# EAGLE design LTC_Balancer3 (EAGLE 5.06)
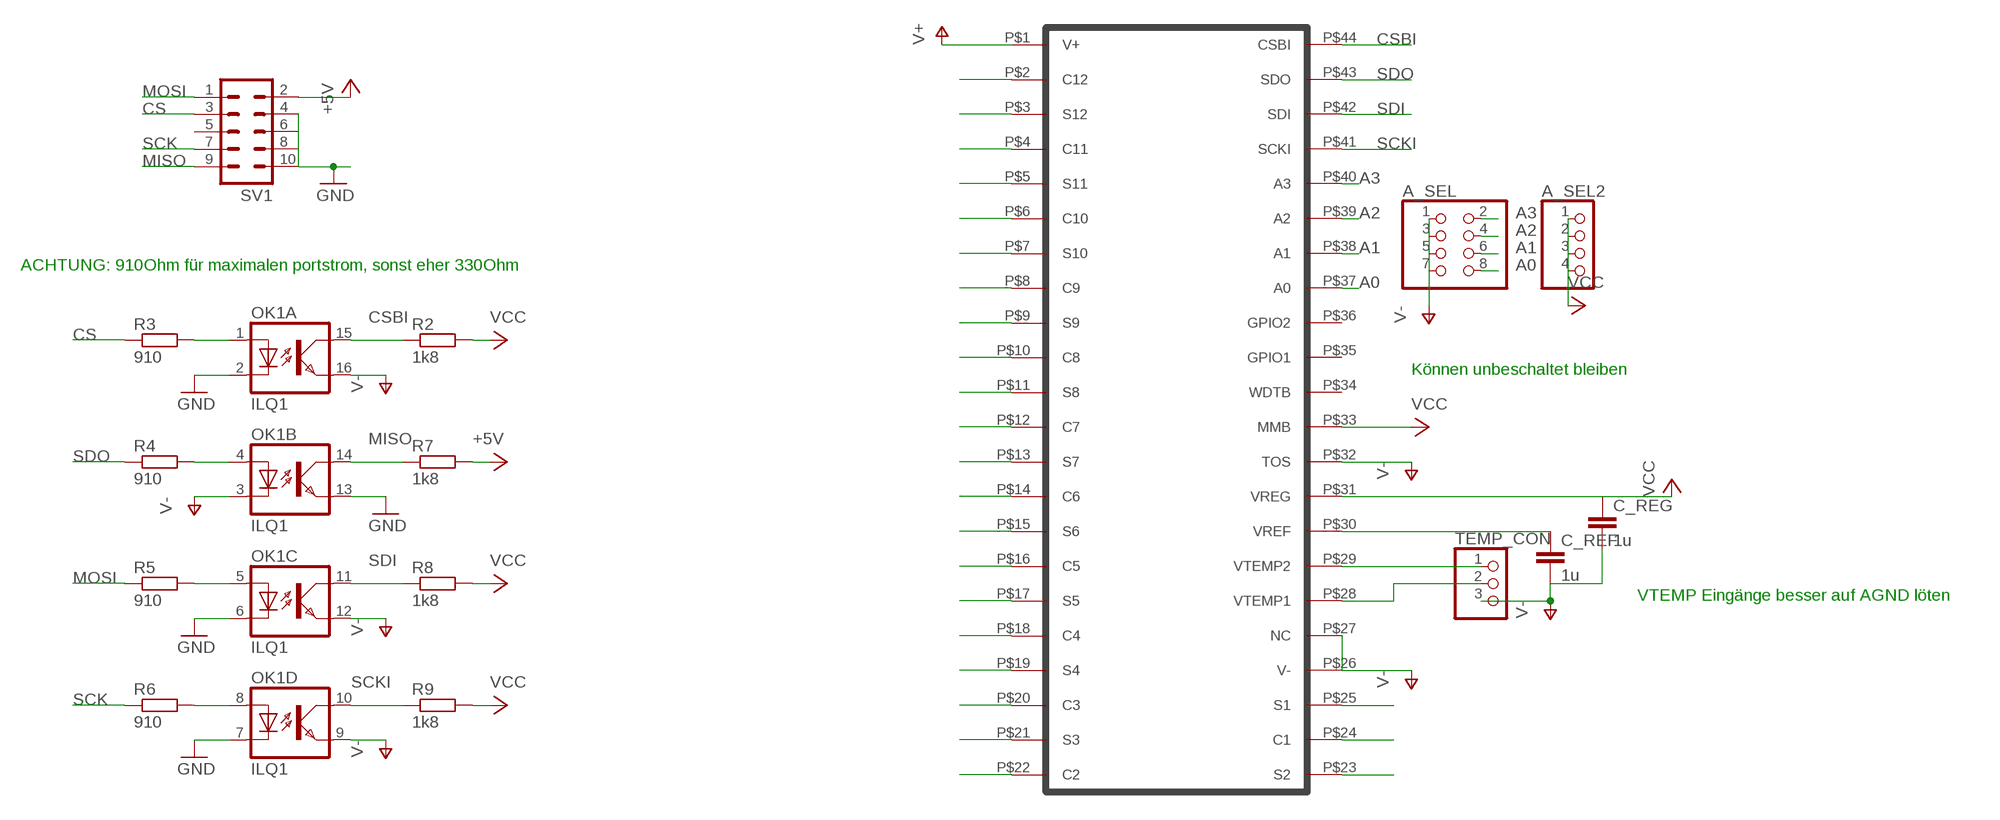
[diagram p0: schematic, sheet 1, part 1 of 2]
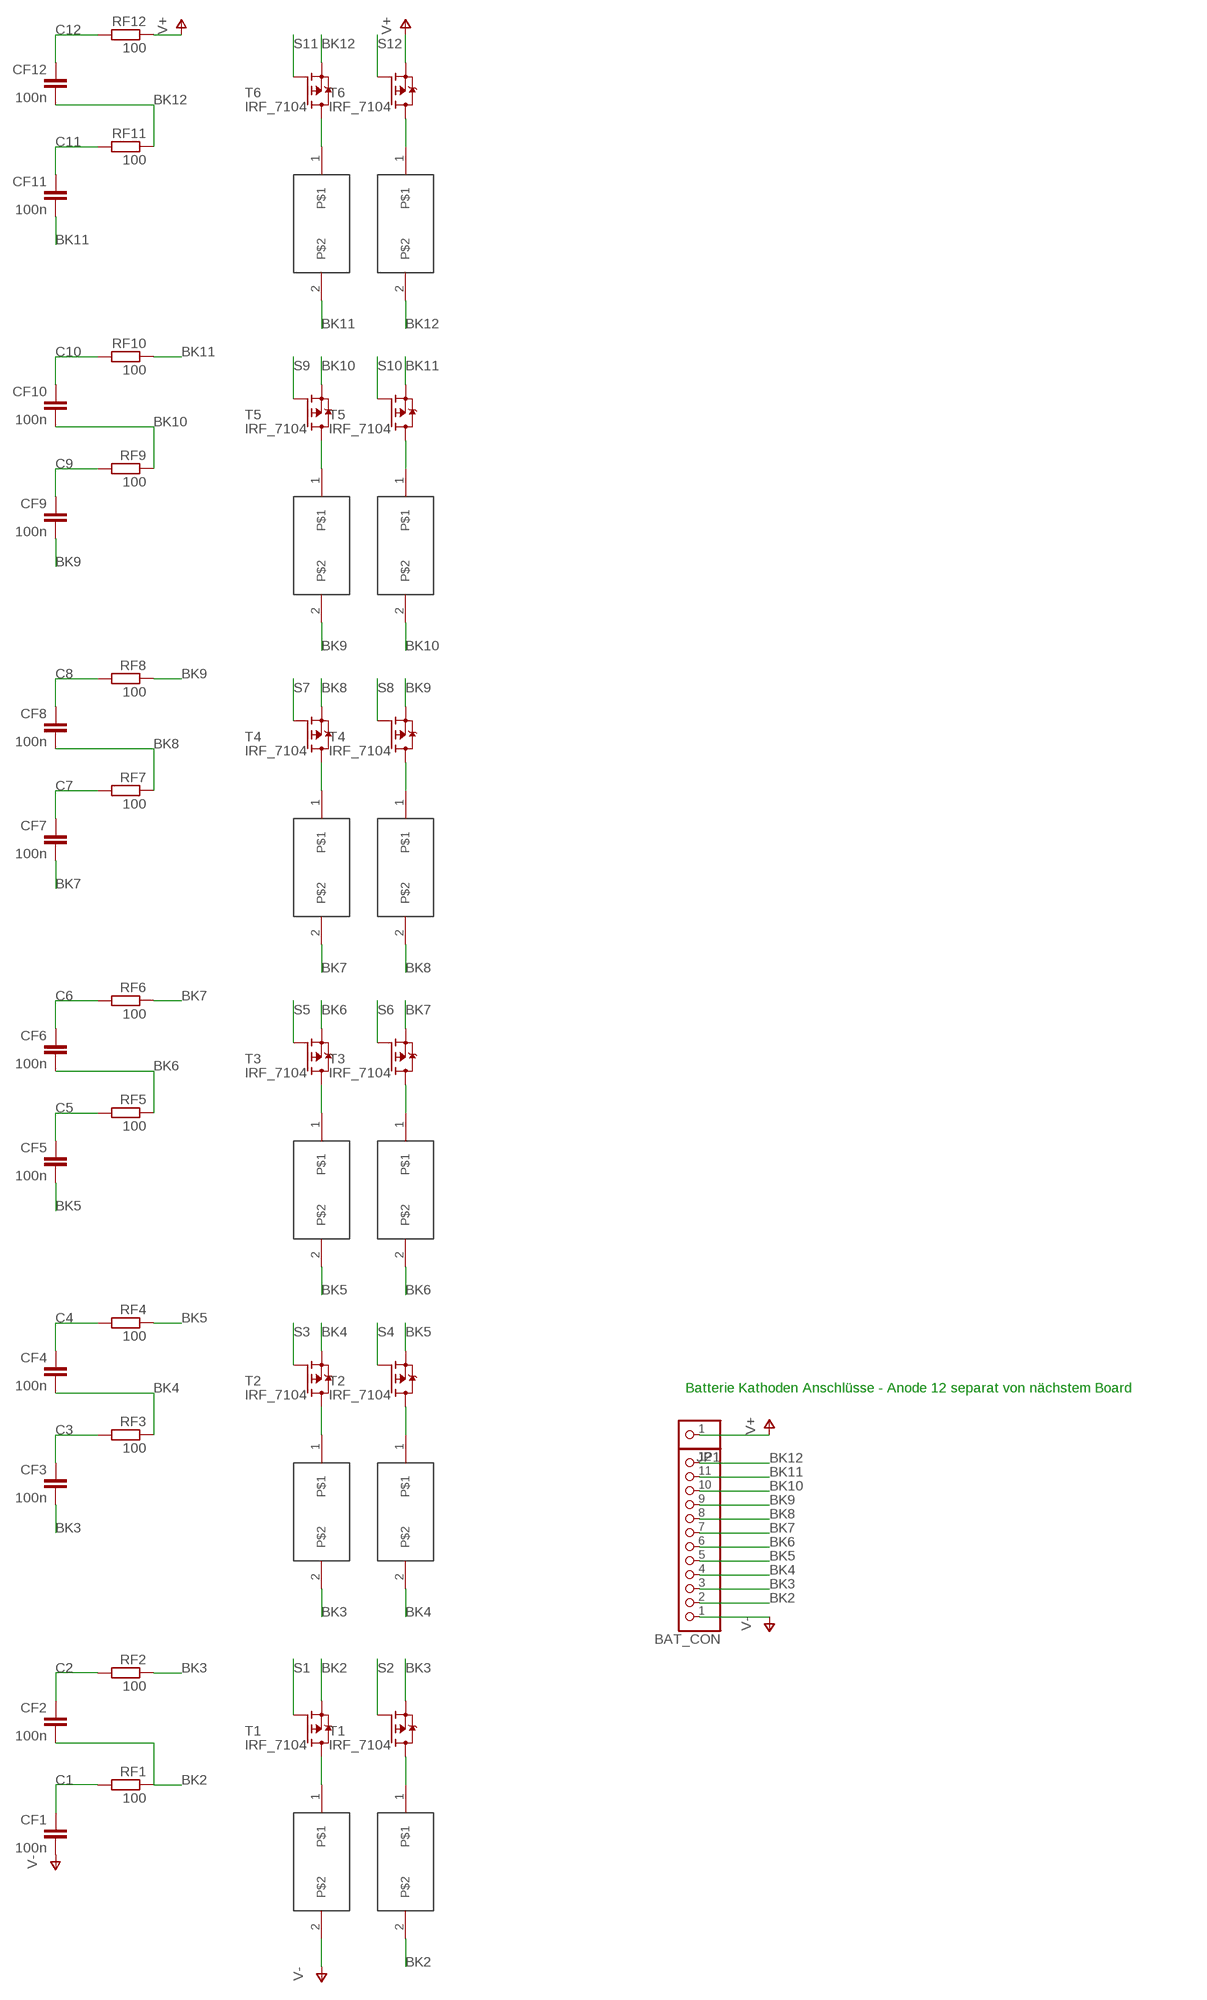
[diagram p1: schematic, sheet 1, part 2 of 2]

## Parts
A_SEL  PINHD-2X4  [2X04]
A_SEL2  PINHD-1X4  [1X04]
BAT_CON  PINHD-1X12  [1X12]
C_REF  1u  C-EUC1206  [C1206]
C_REG  1u  C-EUC1206  [C1206]
CF1  100n  C-EUC1206  [C1206]
CF2  100n  C-EUC1206  [C1206]
CF3  100n  C-EUC1206  [C1206]
CF4  100n  C-EUC1206  [C1206]
CF5  100n  C-EUC1206  [C1206]
CF6  100n  C-EUC1206  [C1206]
CF7  100n  C-EUC1206  [C1206]
CF8  100n  C-EUC1206  [C1206]
CF9  100n  C-EUC1206  [C1206]
CF10  100n  C-EUC1206  [C1206]
CF11  100n  C-EUC1206  [C1206]
CF12  100n  C-EUC1206  [C1206]
JP1  PINHD-1X1  [1X01]
OK1  ILQ1  [DIL16]
R2  1k8  R-EU_R1206  [R1206]
R3  910  R-EU_R1206  [R1206]
R4  910  R-EU_R1206  [R1206]
R5  910  R-EU_R1206  [R1206]
R6  910  R-EU_R1206  [R1206]
R7  1k8  R-EU_R1206  [R1206]
R8  1k8  R-EU_R1206  [R1206]
R9  1k8  R-EU_R1206  [R1206]
RF1  100  R-EU_R1206  [R1206]
RF2  100  R-EU_R1206  [R1206]
RF3  100  R-EU_R1206  [R1206]
RF4  100  R-EU_R1206  [R1206]
RF5  100  R-EU_R1206  [R1206]
RF6  100  R-EU_R1206  [R1206]
RF7  100  R-EU_R1206  [R1206]
RF8  100  R-EU_R1206  [R1206]
RF9  100  R-EU_R1206  [R1206]
RF10  100  R-EU_R1206  [R1206]
RF11  100  R-EU_R1206  [R1206]
RF12  100  R-EU_R1206  [R1206]
RL1  R_5W  [R_5W]
RL2  R_5W  [R_5W]
RL3  R_5W  [R_5W]
RL4  R_5W  [R_5W]
RL5  R_5W  [R_5W]
RL6  R_5W  [R_5W]
RL7  R_5W  [R_5W]
RL8  R_5W  [R_5W]
RL9  R_5W  [R_5W]
RL10  R_5W  [R_5W]
RL11  R_5W  [R_5W]
RL12  R_5W  [R_5W]
SV1  ML10  [ML10]
T1  IRF_7104  [SO8]
T2  IRF_7104  [SO8]
T3  IRF_7104  [SO8]
T4  IRF_7104  [SO8]
T5  IRF_7104  [SO8]
T6  IRF_7104  [SO8]
TEMP_CON  PINHD-1X3  [1X03]
U$1  LTC6802-2  [SSOP48]

## Nets
+5V: R7.2 SV1.2
A0: A_SEL.8 U$1.P$37(A0)
A1: A_SEL.6 U$1.P$38(A1)
A2: A_SEL.4 U$1.P$39(A2)
A3: A_SEL.2 U$1.P$40(A3)
ASD: RL5.1 T3.7(D2)
BK2: BAT_CON.2 CF2.2 RF1.1 RL2.2 T1.1(S2)
BK3: BAT_CON.3 CF3.2 RF2.1 RL3.2 T1.3(S1)
BK4: BAT_CON.4 CF4.2 RF3.1 RL4.2 T2.1(S2)
BK5: BAT_CON.5 CF5.2 RF4.1 RL5.2 T2.3(S1)
BK6: BAT_CON.6 CF6.2 RF5.1 RL6.2 T3.1(S2)
BK7: BAT_CON.7 CF7.2 RF6.1 RL7.2 T3.3(S1)
BK8: BAT_CON.8 CF8.2 RF7.1 RL8.2 T4.1(S2)
BK9: BAT_CON.9 CF9.2 RF8.1 RL9.2 T4.3(S1)
BK10: BAT_CON.10 CF10.2 RF9.1 RL10.2 T5.1(S2)
BK11: BAT_CON.11 CF11.2 RF10.1 RL11.2 T5.3(S1)
BK12: BAT_CON.12 CF12.2 RF11.1 RL12.2 T6.1(S2)
C1: CF1.1 RF1.2 U$1.P$24(C1)
C2: CF2.1 RF2.2 U$1.P$22(C2)
C3: CF3.1 RF3.2 U$1.P$20(C3)
C4: CF4.1 RF4.2 U$1.P$18(C4)
C5: CF5.1 RF5.2 U$1.P$16(C5)
C6: CF6.1 RF6.2 U$1.P$14(C6)
C7: CF7.1 RF7.2 U$1.P$12(C7)
C8: CF8.1 RF8.2 U$1.P$10(C8)
C9: CF9.1 RF9.2 U$1.P$8(C9)
C10: CF10.1 RF10.2 U$1.P$6(C10)
C11: CF11.1 RF11.2 U$1.P$4(C11)
C12: CF12.1 RF12.2 U$1.P$2(C12)
CS: R3.1 SV1.3
CSBI: OK1.15(A:COL) R2.1 U$1.P$44(CSBI)
GND: OK1.2(A:C) OK1.6(C:C) OK1.7(D:C) OK1.13(B:EMIT) SV1.4 SV1.6 SV1.8 SV1.10
MISO: OK1.14(B:COL) R7.1 SV1.9
MOSI: R5.1 SV1.1
N$1: OK1.1(A:A) R3.2
N$2: TEMP_CON.1 U$1.P$29(VTEMP2)
N$3: C_REF.1 U$1.P$30(VREF)
N$4: TEMP_CON.2 U$1.P$28(VTEMP1)
N$5: RL3.1 T2.7(D2)
N$6: RL4.1 T2.5(D1)
N$8: RL1.1 T1.7(D2)
N$9: RL2.1 T1.5(D1)
N$10: RL6.1 T3.5(D1)
N$11: RL7.1 T4.7(D2)
N$12: RL8.1 T4.5(D1)
N$13: RL9.1 T5.7(D2)
N$14: RL10.1 T5.5(D1)
N$15: RL11.1 T6.7(D2)
N$16: RL12.1 T6.5(D1)
N$19: OK1.4(B:A) R4.2
N$20: OK1.5(C:A) R5.2
N$21: OK1.8(D:A) R6.2
S1: T1.2(G2) U$1.P$25(S1)
S2: T1.4(G1) U$1.P$23(S2)
S3: T2.2(G2) U$1.P$21(S3)
S4: T2.4(G1) U$1.P$19(S4)
S5: T3.2(G2) U$1.P$17(S5)
S6: T3.4(G1) U$1.P$15(S6)
S7: T4.2(G2) U$1.P$13(S7)
S8: T4.4(G1) U$1.P$11(S8)
S9: T5.2(G2) U$1.P$9(S9)
S10: T5.4(G1) U$1.P$7(S10)
S11: T6.2(G2) U$1.P$5(S11)
S12: T6.4(G1) U$1.P$3(S12)
SCK: R6.1 SV1.7
SCKI: OK1.10(D:COL) R9.1 U$1.P$41(SCKI)
SDI: OK1.11(C:COL) R8.1 U$1.P$42(SDI)
SDO: R4.1 U$1.P$43(SDO)
V+: JP1.1 RF12.1 T6.3(S1)
V-: A_SEL.1 A_SEL.3 A_SEL.5 A_SEL.7 BAT_CON.1 C_REF.2 C_REG.2 CF1.2 OK1.3(B:C) OK1.9(D:EMIT) OK1.12(C:EMIT) OK1.16(A:EMIT) RL1.2 TEMP_CON.3 U$1.P$26(V-) U$1.P$27(NC) U$1.P$32(TOS)
VCC: A_SEL2.1 A_SEL2.2 A_SEL2.3 A_SEL2.4 C_REG.1 R2.2 R8.2 R9.2 U$1.P$31(VREG) U$1.P$33(MMB)
Unconnected: SV1.5 U$1.P$1(V+) U$1.P$34(WDTB) U$1.P$35(GPIO1) U$1.P$36(GPIO2)

## Notes on the sheet
- Batterie Kathoden Anschlüsse - Anode 12 separat von nächstem Board
- ACHTUNG: 910Ohm für maximalen portstrom, sonst eher 330Ohm
- Können unbeschaltet bleiben
- VTEMP Eingänge besser auf AGND löten

## Library data of the parts
A_SEL = pinhead:PINHD-2X4: PIN HEADER
A_SEL2 = pinhead:PINHD-1X4: PIN HEADER
BAT_CON = pinhead:PINHD-1X12: PIN HEADER
C_REF C_REG CF1-CF12 = rcl:C-EU: CAPACITOR, European symbol
JP1 = pinhead:PINHD-1X1: PIN HEADER
OK1 = optocoupler:ILQ1: SIEMENS OPTO COUPLER
R2-R9 RF1-RF12 = rcl:R-EU_: RESISTOR, European symbol
RL1-RL12 = R_Power:R_5W
SV1 = con-ml:ML10: HARTING
T1-T6 = IRF_7104:IRF_7104
TEMP_CON = pinhead:PINHD-1X3: PIN HEADER
U$1 = LTC6802:LTC6802-2

## Board
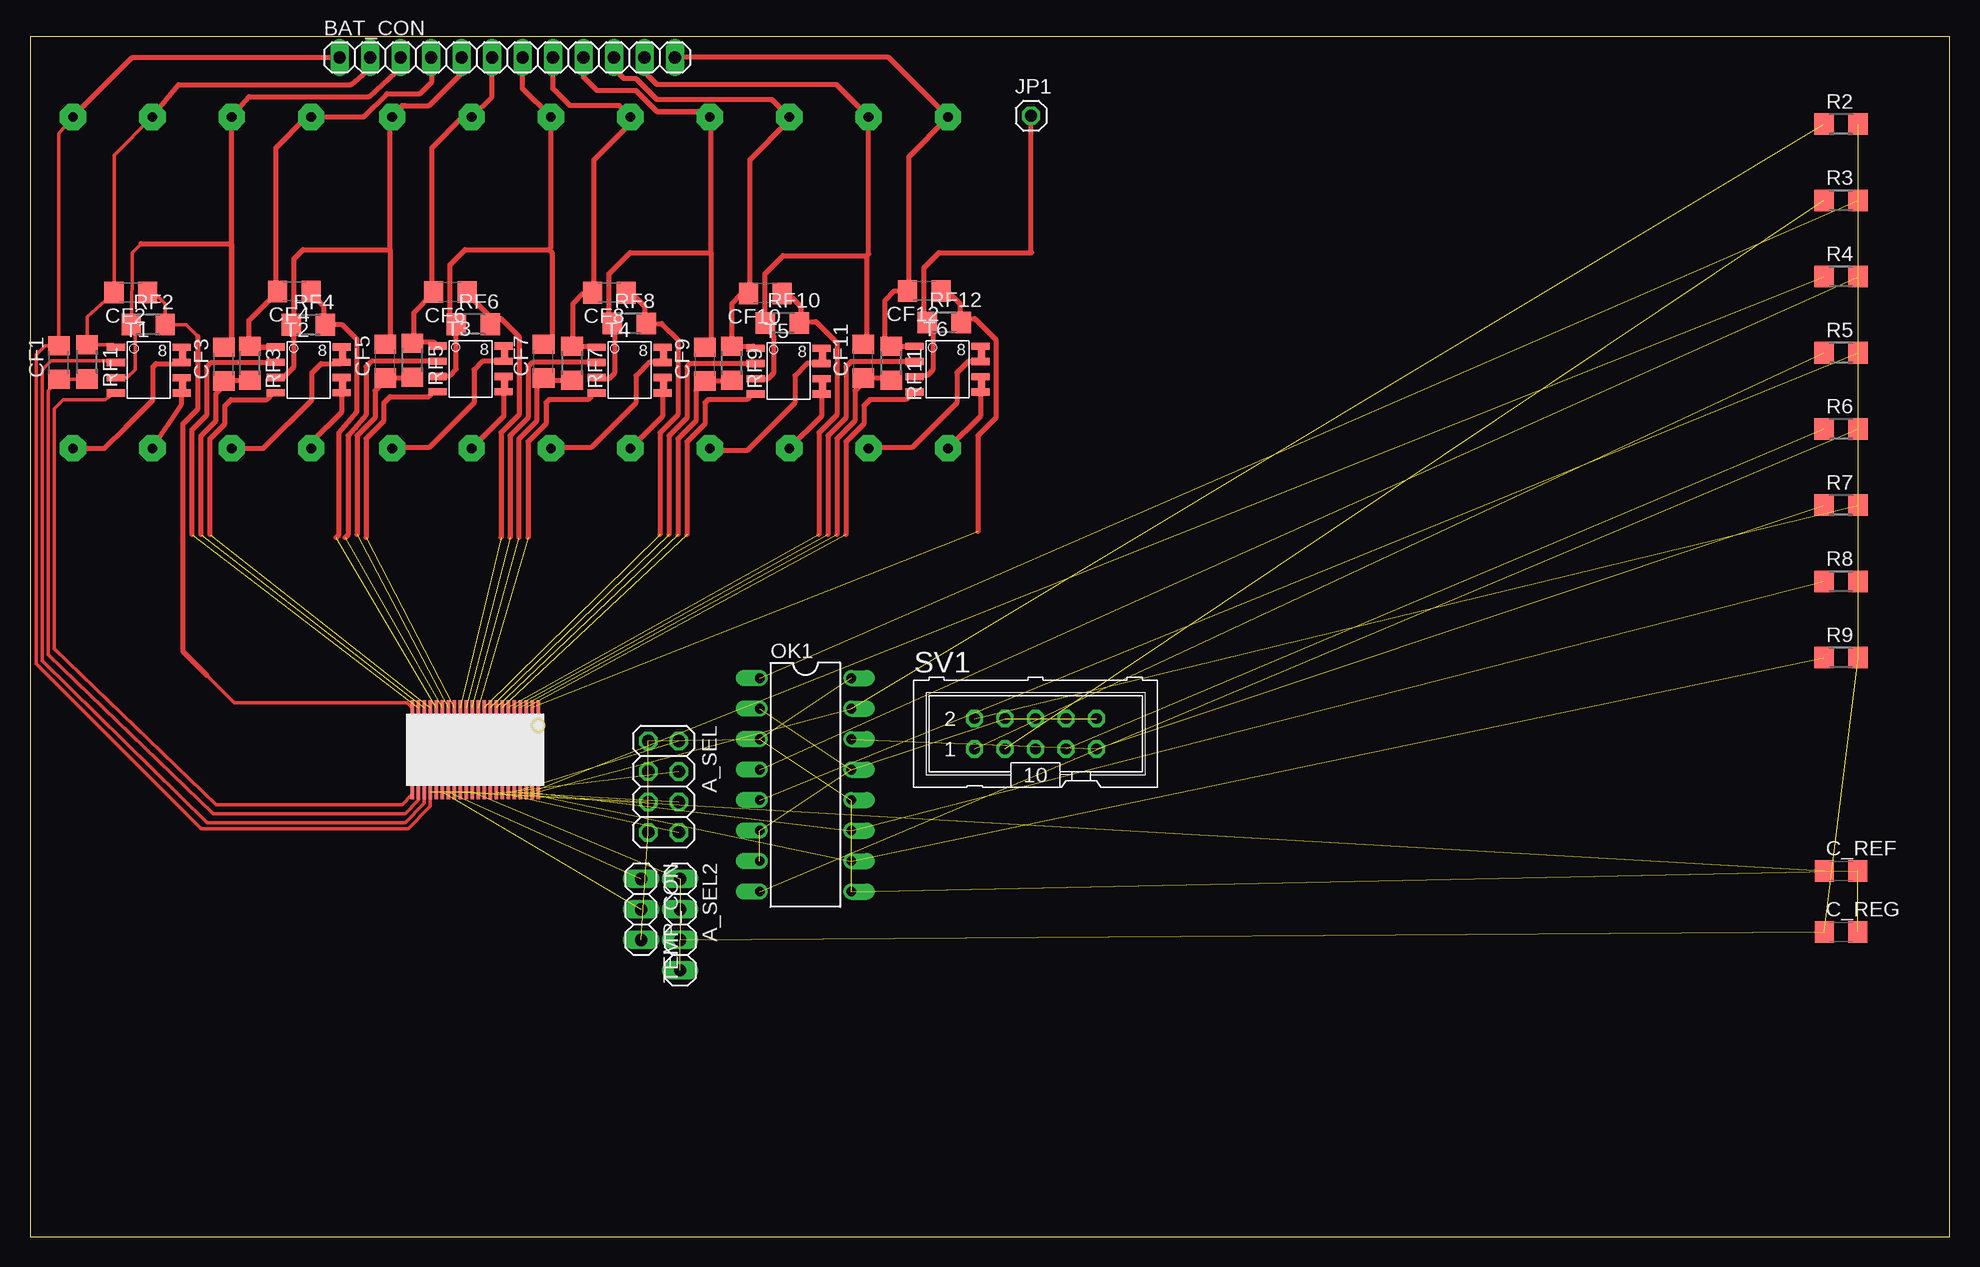
[diagram p2: board, top side]
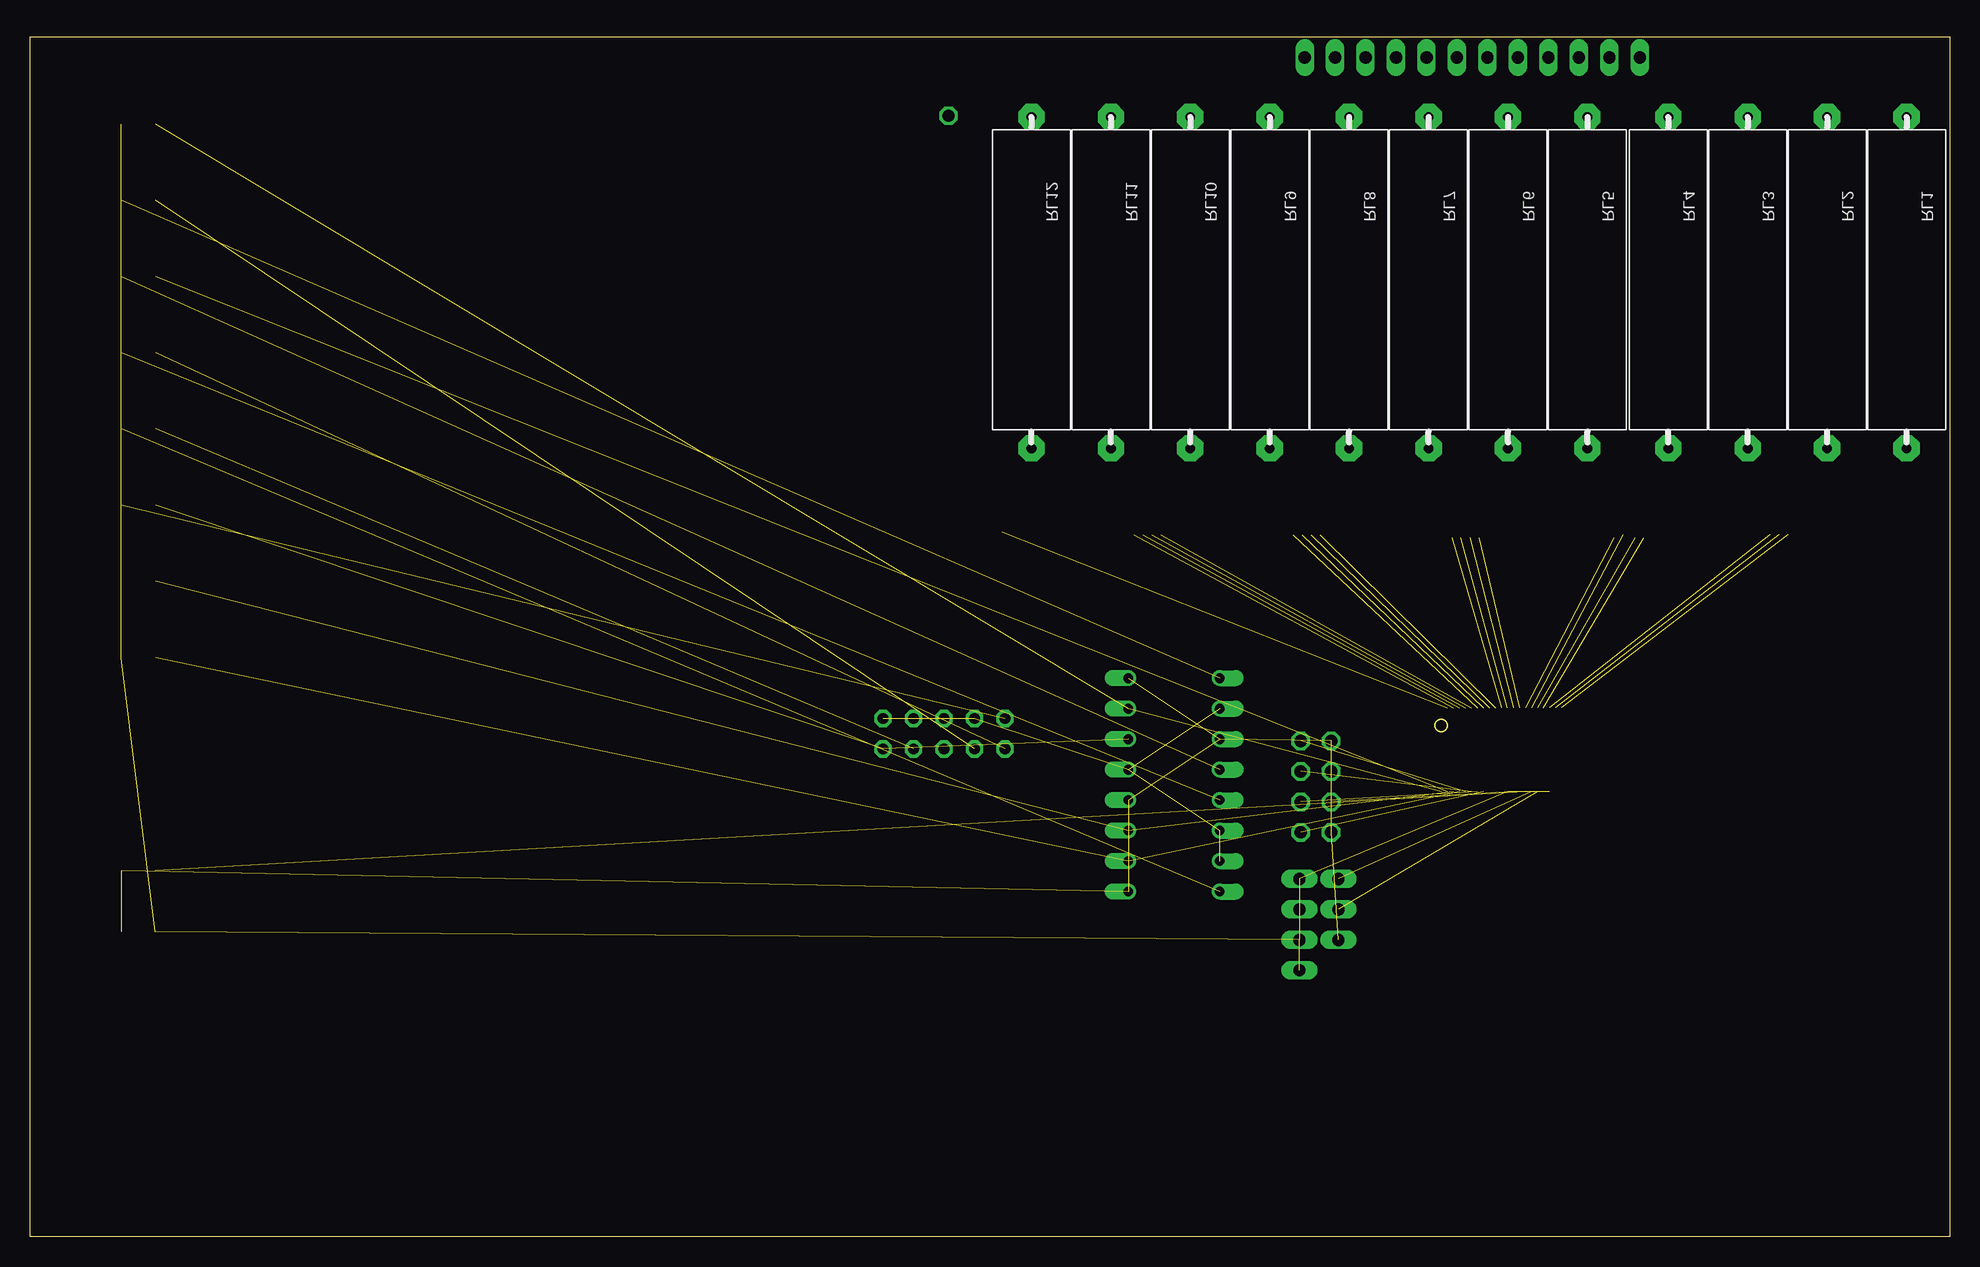
[diagram p3: board, bottom side, seen from below]

Size 160 x 100 mm. Coordinates in mm from the lower left corner, seen from the top.
Outline: 0,0 160,0 160,100 0,100 0,0
Copper layers (1*16): Top 0.035mm / dielectric 1.5mm / Bottom 0.035mm
Design rules "default": minimum track width 10mil, minimum drill 24mil, track to track 8mil, track to pad 8mil, pad to pad 8mil, via to via 8mil, smd to smd 8mil, copper to edge 40mil, drill to drill 8mil, minimum pad ring 10mil, minimum via ring 8mil, stop-mask expansion 4mil, vias tented up to drill 0mil, thermal gap 10mil

### Footprints (pad centres in the part's own frame; a part is rotated, then mirrored left to right if it is on the bottom)
2X04 = drill 1.016 octagon: 1 -3.81,-1.27; 2 -3.81,1.27; 3 -1.27,-1.27; 4 -1.27,1.27; 5 1.27,-1.27; 6 1.27,1.27; 7 3.81,-1.27; 8 3.81,1.27
1X04 = drill 1.016 long: 1 -3.81,0; 2 -1.27,0; 3 1.27,0; 4 3.81,0
1X12 = drill 1.016 long: 1 -13.97,0; 2 -11.43,0; 3 -8.89,0; 4 -6.35,0; 5 -3.81,0; 6 -1.27,0; 7 1.27,0; 8 3.81,0; 9 6.35,0; 10 8.89,0; 11 11.43,0; 12 13.97,0
C1206 = smd 1.6 x 1.8: 1 -1.4,0; 2 1.4,0
1X01 = drill 1.016 octagon: 1 0,0
DIL16 = drill 0.813 offset: 1 -8.89,-3.81; 2 -6.35,-3.81; 3 -3.81,-3.81; 4 -1.27,-3.81; 5 1.27,-3.81; 6 3.81,-3.81; 7 6.35,-3.81; 8 8.89,-3.81; 9 8.89,3.81; 10 6.35,3.81; 11 3.81,3.81; 12 1.27,3.81; 13 -1.27,3.81; 14 -3.81,3.81; 15 -6.35,3.81; 16 -8.89,3.81
R1206 = smd 1.6 x 1.803: 1 -1.422,0; 2 1.422,0
R_5W = drill 0.813 pad 2.184 octagon: 1 0.46,0; 2 28.08,0
ML10 = drill 0.914 octagon: 1 -5.08,-1.27; 2 -5.08,1.27; 3 -2.54,-1.27; 4 -2.54,1.27; 5 0,-1.27; 6 0,1.27; 7 2.54,-1.27; 8 2.54,1.27; 9 5.08,-1.27; 10 5.08,1.27
SO8 = smd 1.524 x 0.61: 1 1.067,4.445; 2 1.067,3.175; 3 1.067,1.905; 4 1.067,0.635; 5 6.553,0.635; 6 6.553,1.905; 7 6.553,3.175; 8 6.553,4.445 | smd 0.61 x 1.524: 9 6.635,3.703; 10 6.635,1.203
1X03 = drill 1.016 long: 1 -2.54,0; 2 0,0; 3 2.54,0
SSOP48 = smd 0.3 x 1.25: P$1 0,0.5; P$2 0.5,0.5; P$3 1,0.5; P$4 1.5,0.5; P$5 2,0.5; P$6 2.5,0.5; P$7 3,0.5; P$8 3.5,0.5; P$9 4,0.5; P$10 4.5,0.5; P$11 5,0.5; P$12 5.5,0.5; P$13 6,0.5; P$14 6.5,0.5; P$15 7,0.5; P$16 7.5,0.5; P$17 8,0.5; P$18 8.5,0.5; P$19 9,0.5; P$20 9.5,0.5; P$21 10,0.5; P$22 10.5,0.5; P$23 10.5,7.5; P$24 10,7.5; P$25 9.5,7.5; P$26 9,7.5; P$27 8.5,7.5; P$28 8,7.5; P$29 7.5,7.5; P$30 7,7.5; P$31 6.5,7.5; P$32 6,7.5; P$33 5.5,7.5; P$34 5,7.5; P$35 4.5,7.5; P$36 4,7.5; P$37 3.5,7.5; P$38 3,7.5; P$39 2.5,7.5; P$40 2,7.5; P$41 1.5,7.5; P$42 1,7.5; P$43 0.5,7.5; P$44 0,7.5

### Placement (x,y rotation side)
A_SEL  52.81,37.5 270 top
A_SEL2  54.19,26 270 top
BAT_CON  39.78,98.27 0 top
C_REF  150.96,30.48 0 top
C_REG  150.96,25.4 0 top
CF1  2.41,72.85 90 top
CF2  8.4,78.67 180 top
CF3  16.16,72.71 90 top
CF4  22.04,78.76 180 top
CF5  29.61,72.96 90 top
CF6  35.04,78.71 180 top
CF7  42.81,72.96 90 top
CF8  48.29,78.66 180 top
CF9  56.26,72.71 90 top
CF10  61.29,78.61 180 top
CF11  69.46,72.96 90 top
CF12  74.54,78.81 180 top
JP1  83.44,93.41 0 top
OK1  64.64,37.65 270 top
R2  150.96,92.71 0 top
R3  150.96,86.36 0 top
R4  150.96,80.01 0 top
R5  150.96,73.66 0 top
R6  150.96,67.31 0 top
R7  150.96,60.96 0 top
R8  150.96,54.61 0 top
R9  150.96,48.26 0 top
RF1  4.76,72.9 270 top
RF2  9.85,76 0 top
RF3  18.34,72.79 270 top
RF4  23.21,75.99 0 top
RF5  31.89,73.04 270 top
RF6  36.96,76.04 0 top
RF7  45.19,72.79 270 top
RF8  49.96,76.09 0 top
RF9  58.49,72.79 270 top
RF10  62.71,76.14 0 top
RF11  71.79,72.79 270 top
RF12  76.21,76.19 0 top
RL1  3.58,65.23 90 top
RL2  10.2,65.23 90 top
RL3  16.82,65.23 90 top
RL4  23.44,65.23 90 top
RL5  30.18,65.23 90 top
RL6  36.81,65.23 90 top
RL7  43.42,65.23 90 top
RL8  50.05,65.23 90 top
RL9  56.66,65.23 90 top
RL10  63.29,65.23 90 top
RL11  69.9,65.23 90 top
RL12  76.53,65.23 90 top
SV1  83.82,41.91 0 top
T1  6.09,69.67 0 top
T2  19.42,69.69 0 top
T3  32.92,69.77 0 top
T4  46.17,69.68 0 top
T5  59.42,69.59 0 top
T6  72.67,69.75 0 top
TEMP_CON  50.93,27.27 270 top
U$1  42.36,44.59 180 top

### Tracks (layer width: path | path; a pad name or v marks a point on that pad's centre or on a via)
+5V  (1 unrouted)
A0  (1 unrouted)
A1  (1 unrouted)
A2  (1 unrouted)
A3  (1 unrouted)
ASD
  Top 0.406: T3.7 37.7,72.94 37,72.25 37,69.5 33.25,65.75 30.24,65.75 RL5.1
BK2
  Top 0.305: RF1.1 6.95,74.32 | 6.95,74.32 T1.1 | 6.95,74.32 4.43,74.32 4.75,74.5 4.75,76.67 CF2.2 7,90.11 RL2.2
  Top 0.406: BAT_CON.2 28.35,97.35 26.75,96 12.39,96 RL2.2
BK3
  Top 0.305: 9.25,82.75 8.5,82 8.5,79.82 RF2.1 8.75,76.18 8.75,72.25 8.07,71.58 T1.3
  Top 0.406: BAT_CON.3 31.02,97.52 28.25,95 18.26,95 RL3.2 16.82,73.7 | 16.82,73.7 CF3.2 | 16.82,73.7 16.82,82.68 16.75,82.75 9.25,82.75
BK4
  Top 0.406: BAT_CON.4 33.5,97.34 33.5,96.25 32.5,95.25 29.75,95.25 27.81,93.31 RL4.2 23.06,93.31 20.5,90.75 20.5,78.9 CF4.2 18.25,76.37 18.25,74.25 18.36,74.14 T2.1 18.42,74.14 RF3.1
BK5
  Top 0.406: 31.25,94.25 31.12,94.25 RL5.2 | BAT_CON.5 36.22,97.22 33.25,94.25 31.25,94.25 | 31.25,94.25 31,94.25 30,93.25 30,82.25 | 30,82.25 22.75,82.25 22,81.5 22,76.45 RF4.1 22,75.78 22,72.5 21.09,71.59 T2.3 | CF5.2 29.75,74.5 30,74.5 30,82.25
BK6
  Top 0.406: BAT_CON.6 38.51,95.01 RL6.2 36.06,93.31 33.5,90.75 33.5,78.85 CF6.2 33.64,78.64 32,77 32,74.57 | RF5.1 32,74.57 | 32,74.57 33.63,74.57 T3.1
BK7
  Top 0.406: BAT_CON.7 41.05,95.68 RL7.2 43.42,82.42 43.25,82.25 | 43.25,82.25 36.25,82.25 35,81 35,76.33 RF6.1 35.54,72.29 35,71.75 34.06,71.75 T3.3 | CF7.2 42.86,74.36 43.5,75 43.5,82 43.25,82.25
BK8
  Top 0.406: BAT_CON.8 43.59,95.66 45,94.25 49.11,94.25 RL8.2 50.05,92.8 47,89.75 47,78.77 CF8.2 46.16,78.66 45.25,77.75 45.25,74.52 RF7.1 46.9,74.21 T4.1
BK9
  Top 0.406: BAT_CON.9 46.13,96.62 47.25,95.5 50.5,95.5 52.25,93.75 | 52.25,93.75 56.22,93.75 RL9.2 | 52.25,93.75 56.25,93.75 56.75,93.25 56.75,82 | 56.75,82 50,82 48.25,80.25 48.25,76.38 RF8.1 48.54,75.71 48.75,75.5 48.75,72 48.25,71.5 47.32,71.5 T4.3 | CF9.2 56.36,74.11 56.75,74.5 56.75,82
BK10
  Top 0.406: BAT_CON.10 48.67,97.33 49.5,96.5 50.5,96.5 52.25,94.75 61.85,94.75 RL10.2 63.29,93.04 60,89.75 60,78.72 CF10.2 59.36,78.61 58.5,77.75 58.5,74.22 | RF9.1 58.5,74.22 | 58.5,74.22 60.3,74.22 T5.1
BK11
  Top 0.406: BAT_CON.11 51.21,97.04 52.25,96 67.21,96 RL11.2 69.9,81.9 69.75,81.75 | 69.75,81.75 62.75,81.75 61.25,80.25 61.25,76.18 RF10.1 61.29,75.71 62,75 62,72 61.5,71.5 T5.3 | CF11.2 69.61,74.11 70,74.5 69.75,74.5 69.75,81.75
BK12
  Top 0.406: BAT_CON.12 71.57,98.27 RL12.2 76.53,93.28 73.25,90 73.25,78.92 CF12.2 72.06,78.81 71.25,78 71.25,74.25 RF11.1 73.47,74.21 T6.1
C1
  Top 0.305: U$1.P$24 32.36,36.36 31.25,35.25 15.25,35.25 1.5,48.5 1.5,70.5 CF1.1 4.23,71.45 RF1.2
C2
  Top 0.305: 14.02,47.48 14.75,46.75 17,44.5 31.45,44.5 U$1.P$22 | CF2.1 10.05,78.95 11.25,77.75 11.25,76.52 RF2.2 13,76 14,75
  Top 0.406: 14,75 14,69 12.75,67.75 12.75,48.75 14.75,46.75
C3  (1 unrouted)
  Top 0.406: 16.37,71.37 16.22,71.37 CF3.1 | 16.37,71.37 RF3.2 | 16.37,71.37 16.37,71.12 15.5,70.25 15.5,68 14.25,66.75 14.25,58.5
C4  (1 unrouted)
  Top 0.406: CF4.1 23.44,78.56 24.5,77.5 24.5,76.12 RF4.2 26.01,75.99 27.25,74.75 27.25,68.75 25.75,67 25.75,58.5 25.5,58.25
C5  (1 unrouted)
  Top 0.406: RF5.2 31.83,71.56 CF5.1 29.61,71.36 28.75,70.5 28.75,68.25 27.25,66.75 27.25,58.5
C6  (1 unrouted)
  Top 0.406: 36.44,78.56 38.25,76.75 38.25,76.16 RF6.2 | CF6.1 36.44,78.56 | 36.44,78.56 38.5,76.5 39.25,76.5 40.75,75 40.75,68.5 39.25,67 39.25,58.25
C7  (1 unrouted)
  Top 0.406: 40.75,58.25 40.75,66.5 42.25,68 42.25,70.75 42.81,71.31 CF7.1 43,71.37 RF7.2
C8  (1 unrouted)
  Top 0.406: CF8.1 50.09,78.66 51.25,77.5 51.25,76.22 RF8.2 52.66,76.09 54,74.75 54,68.5 52.5,67 52.5,58.5
C9  (1 unrouted)
  Top 0.406: RF9.2 58.43,71.31 CF9.1 56.26,71.26 55.5,70.5 55.5,68 54,66.5 54,58.5
C10  (1 unrouted)
  Top 0.406: 64.25,77.5 64.25,76.26 RF10.2 | CF10.1 63.14,78.61 64.25,77.5 | 64.25,77.5 64.25,76.25 65.5,76.25 67.25,74.5 67.25,68.5 65.75,67 65.75,58.5
C11  (1 unrouted)
  Top 0.406: RF11.2 71.98,71.56 CF11.1 69.46,71.21 68.75,70.5 68.75,68 67.25,66.5 67.25,58.5
C12  (1 unrouted)
  Top 0.406: 77.5,76.5 77.5,76.32 RF12.2 | CF12.1 76.44,78.81 77.5,77.75 77.5,76.5 | 77.5,76.5 78.75,76.5 80.5,74.75 80.5,68.25 79,66.75 79,58.75
CS  (1 unrouted)
CSBI  (2 unrouted)
GND  (7 unrouted)
MISO  (2 unrouted)
MOSI  (1 unrouted)
N$1  (1 unrouted)
N$2  (1 unrouted)
N$3  (1 unrouted)
N$4  (1 unrouted)
N$5
  Top 0.406: RL3.1 19.44,65.69 23.5,69.75 23.5,72 24.25,72.75 25.86,72.75 T2.7
N$6
  Top 0.406: RL4.1 23.44,66.19 26,68.75 26,70.3 T2.5
N$8
  Top 0.305: RL1.1 3.56,65.72
  Top 0.406: RL1.1 6.19,65.69 8,67.5 10.25,69.75 10.25,72.5 10.5,72.75 12.55,72.75 T1.7
N$9
  Top 0.406: T1.5 12.64,69.38 RL2.1
N$10
  Top 0.406: T3.5 39.47,68.35 RL6.1
N$11
  Top 0.406: T4.7 51.6,72.86 50.5,71.75 50.5,69.5 46.75,65.75 43.48,65.75 RL7.1
N$12
  Top 0.406: T4.5 52.72,68.36 RL8.1
N$13
  Top 0.406: T5.7 64.77,72.77 63.75,71.75 63.75,69.5 59.75,65.5 56.85,65.5 RL9.1
N$14
  Top 0.406: T5.5 65.97,68.37 RL10.1
N$15
  Top 0.406: T6.7 78.17,72.92 77.25,72 77.25,69.5 73.5,65.75 69.96,65.75 RL11.1
N$16
  Top 0.406: T6.5 79.22,68.38 RL12.1
N$19  (1 unrouted)
N$20  (1 unrouted)
N$21  (1 unrouted)
S1
  Top 0.305: U$1.P$25 32.86,36.11 31.25,34.5 14.75,34.5 1,48 1,72.25 1.75,73 7.31,73 T1.2
S2
  Top 0.305: U$1.P$23 31.86,36.86 31,36 15.5,36 2,49 2,69 2.75,69.75 6.25,69.75 7.05,70.31 T1.4
S3  (1 unrouted)
  Top 0.406: T2.2 15.12,72.86 14.75,72.5 14.75,68.5 13.5,67.25 13.5,58.5
S4  (1 unrouted)
  Top 0.406: T2.4 20.32,70.33 19.75,69.75 16.75,69.75 16.25,69.25 16.25,67.75 15,66.5 15,58.5
S5  (1 unrouted)
  Top 0.406: T3.2 28.45,72.94 28,72.5 28,68.5 26.5,66.75 26.5,58.5 26.25,58.25
S6  (1 unrouted)
  Top 0.406: T3.4 33.66,70.41 33.25,70 30,70 29.5,69.5 29.5,68 28,66.5 28,58.25
S7  (1 unrouted)
  Top 0.406: T4.2 41.85,72.86 41.5,72.5 41.5,68.25 40,66.75 40,58.25
S8  (1 unrouted)
  Top 0.406: T4.4 47.06,70.31 46.5,69.75 43.25,69.75 43,69.5 43,67.75 41.5,66.25 41.5,58.25
S9  (1 unrouted)
  Top 0.406: T5.2 55.02,72.77 54.75,72.5 54.75,68.25 53.25,66.75 53.25,58.5
S10  (1 unrouted)
  Top 0.406: T5.4 60.23,70.22 59.75,69.75 56.5,69.75 56.25,69.5 56.25,67.75 54.75,66.25 54.75,58.5
S11  (1 unrouted)
  Top 0.406: T6.2 68.42,72.92 68,72.5 68,68.25 66.5,66.75 66.5,58.5
S12  (1 unrouted)
  Top 0.406: T6.4 73.64,70.39 73,69.75 70,69.75 69.5,69.25 69.5,67.75 68,66.25 68,58.5
SCK  (1 unrouted)
SCKI  (2 unrouted)
SDI  (2 unrouted)
SDO  (1 unrouted)
V+
  Top 0.406: JP1.1 83.44,82.06 83.5,82 75.75,82 74.5,80.75 74.5,76.48 RF12.1 74.79,75.96 75.25,75.5 75.25,72.25 74.75,71.75 73.58,71.75 T6.3
V-  (13 unrouted)
  Top 0.305: U$1.P$26 33.36,35.86 31.5,34 14.25,34 0.5,47.75 0.5,73.5 1.25,74.25 CF1.2 2.41,91.89 RL1.2
  Top 0.406: BAT_CON.1 8.54,98.27 RL1.2
VCC  (9 unrouted)